# Altium schematic sheet Вариант6.SchDoc
size A4; SheetNumber: 6; SheetTotal: 10
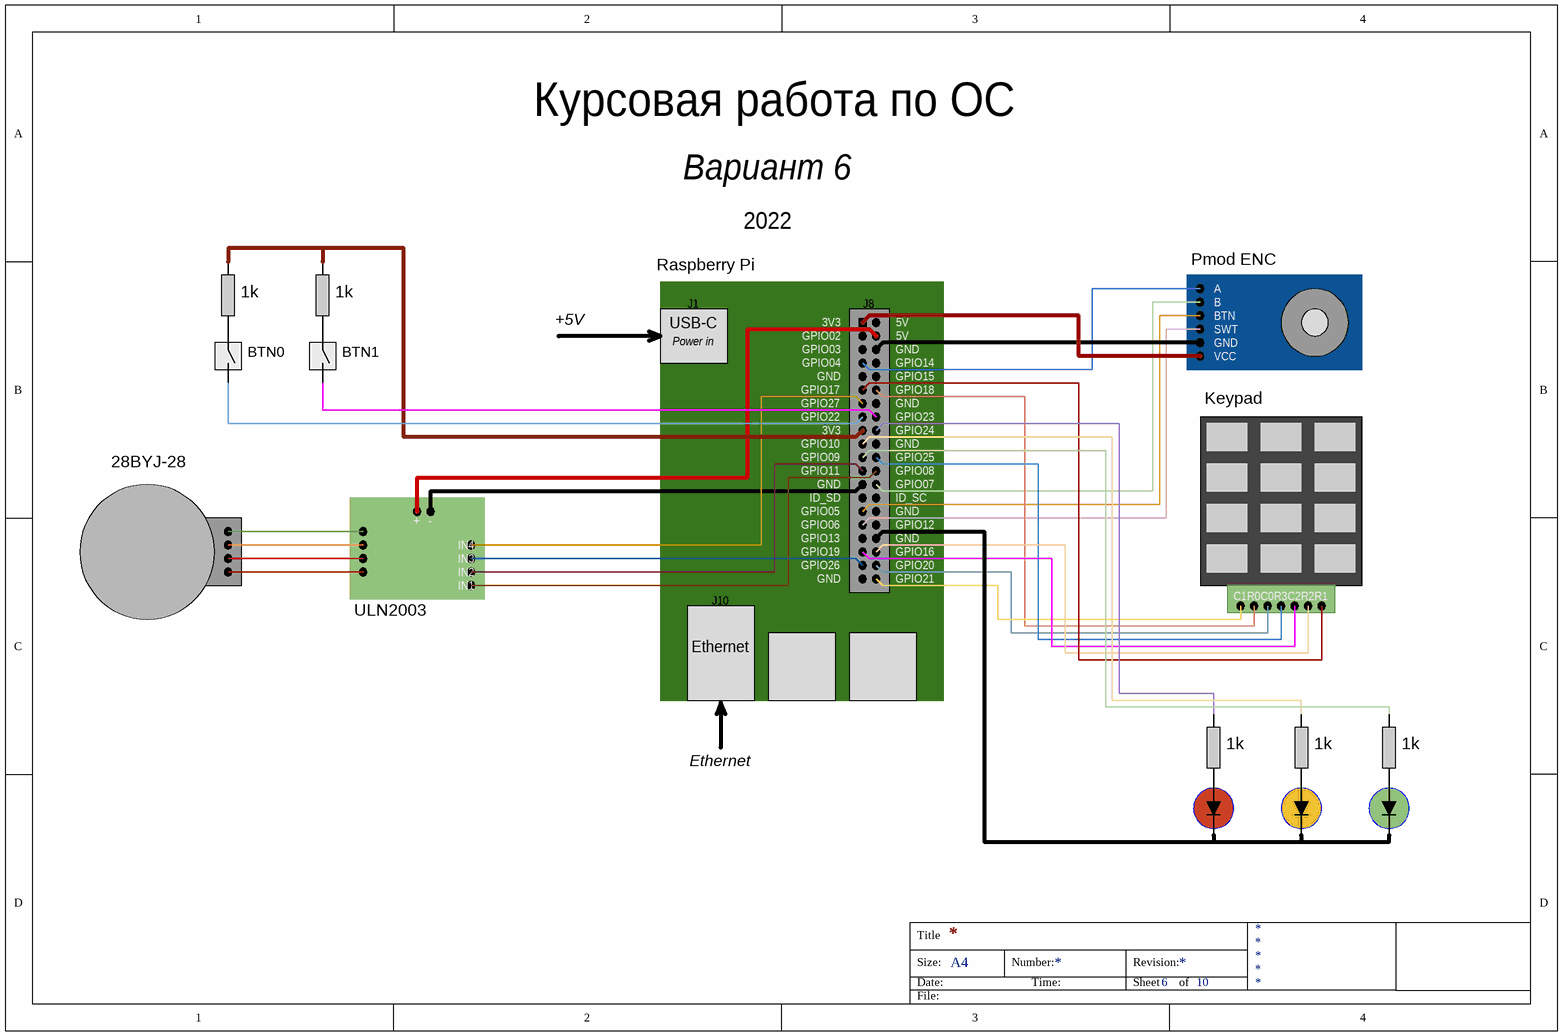
[diagram p0: Вариант6.SchDoc]

## Notes on the sheet
- Курсовая работа по ОС
- Вариант 6
- 2022
- 1k
- +5V
- Raspberry Pi
- J1
- J8
- Pmod ENC
- A
- B
- BTN
- BTN0
- BTN1
- USB-C
- Power in
- GPIO17
- 3V3
- GPIO02
- GPIO03
- GPIO04
- GND
- GPIO14
- GPIO15
- GPIO18
- 5V
- SWT
- VCC
- GPIO27
- GPIO22
- GPIO10
- GPIO23
- GPIO24
- Keypad
- 28BYJ-28
- +
- -
- GPIO09
- GPIO11
- GPIO05
- GPIO06
- ID_SD
- GPIO25
- GPIO08
- GPIO07
- ID_SC
- GPIO12
- IN4
- IN3
- IN2
- IN1
- GPIO13
- GPIO19
- GPIO26
- GPIO16
- GPIO20
- GPIO21
- ULN2003
- Ethernet
- J10
- C1
- R0
- C0
- R3
- C2
- R2
- R1
- Title
- Size:
- Date:
- A4
- Number:
- Time:
- Revision:
- Sheet
- of
- File: